# Altium schematic sheet Power Amplifier.SchDoc
size E
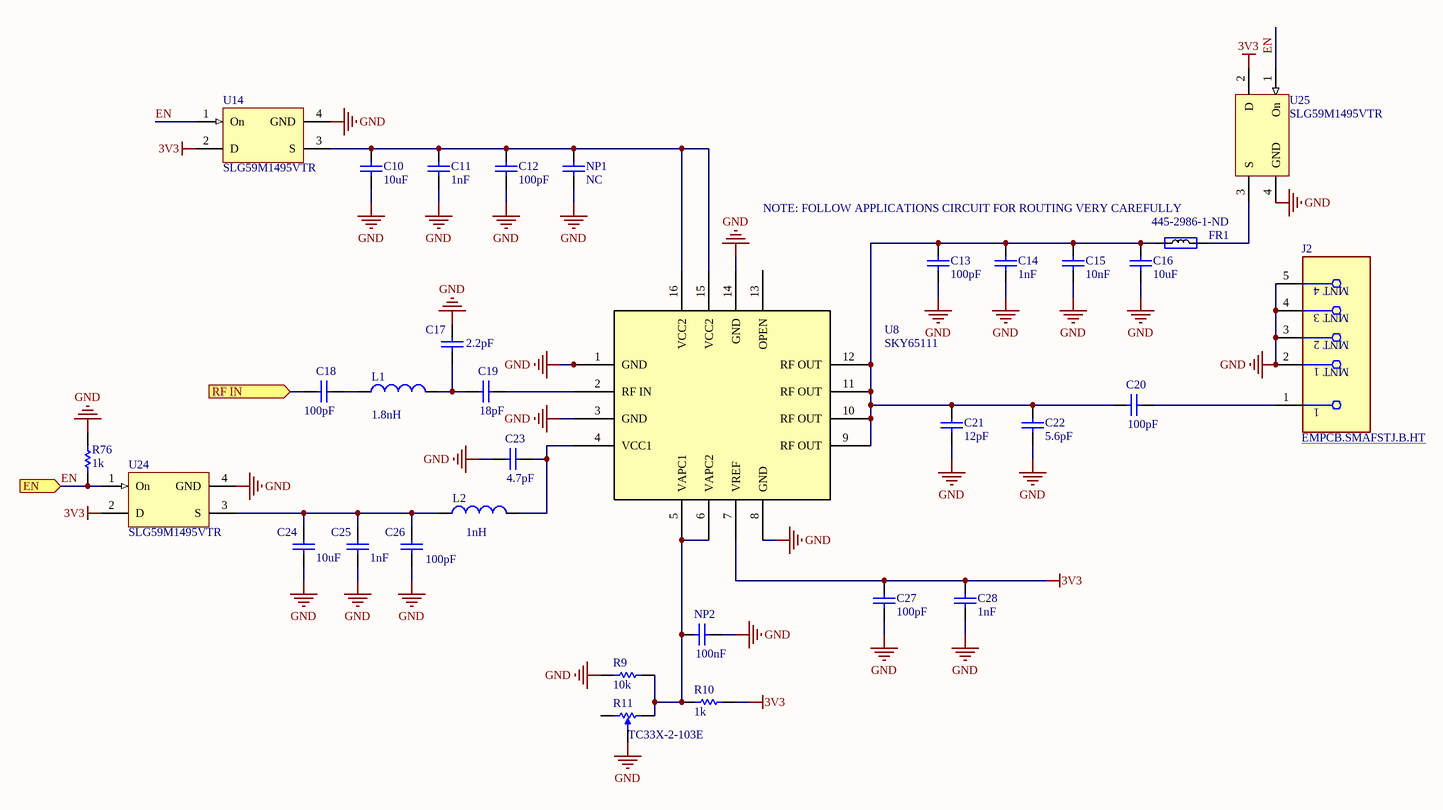
[diagram p0: Power Amplifier.SchDoc]

## Parts
C10  value 10uF  [C1206]  (hidden comment: Cap)
C11  value 1nF  [0402-A]  (hidden comment: Cap)
C12  value 100pF  [0402-A]  (hidden comment: Cap)
C13  value 100pF  [0402-A]  (hidden comment: Cap)
C14  value 1nF  [0402-A]  (hidden comment: Cap)
C15  value 10nF  [0402-A]  (hidden comment: Cap)
C16  value 10uF  [C1206]  (hidden comment: Cap)
C17  value 2.2pF  [0402-A]  (hidden comment: Cap)
C18  value 100pF  [0402-A]  (hidden comment: Cap)
C19  value 18pF  [0402-A]  (hidden comment: Cap)
C20  value 100pF  [0402-A]  (hidden comment: Cap)
C21  value 12pF  [0402-A]  (hidden comment: Cap)
C22  value 5.6pF  [0402-A]  (hidden comment: Cap)
C23  value 4.7pF  [0402-A]  (hidden comment: Cap)
C24  value 10uF  [C1206]  (hidden comment: Cap)
C25  value 1nF  [0402-A]  (hidden comment: Cap)
C26  value 100pF  [0402-A]  (hidden comment: Cap)
C27  value 100pF  [0402-A]  (hidden comment: Cap)
C28  value 1nF  [0402-A]  (hidden comment: Cap)
FR1  Supplier Part Number 1: 445-2986-1-ND  [1608[0603]]  (hidden comment: 200R, 1.8A)
J2  EMPCB.SMAFSTJ.B.HT  [FP-EMPCB_SMAFSTJ_B_HT-MFG]
L1  value 1.8nH  [0402-A]  (hidden comment: Inductor)
L2  value 1nH  [0402-A]  (hidden comment: Inductor)
NP1  value NC  [0402-A]  (hidden comment: Cap)
NP2  value 100nF  [0402-A]  (hidden comment: Cap)
R9  value 10k  [0402-A]  (hidden comment: Res1)
R10  value 1k  [0402-A]  (hidden comment: Res1)
R11  TC33X-2-103E  [BOUR-TC33X-2_V]
R76  value 1k  [0402-A]  (hidden comment: Res1)
U8  SKY65111  [SKY65111]
U14  SLG59M1495VTR  [SLG59M1495VTR]
U24  SLG59M1495VTR  [SLG59M1495VTR]
U25  SLG59M1495VTR  [SLG59M1495VTR]

## Ports
EN (in), RF IN (in)

## Nets
3V3: C27.2 C28.2 R10.2 U8.7(VREF) U14.2(D) U24.2(D) U25.2(D)
GND: C10.1 C11.1 C12.1 C13.1 C14.1 C15.1 C16.1 C17.1 C21.1 C22.1 C23.1 C24.1 C25.1 C26.1 C27.1 C28.1 J2.2(MNT_1) J2.3(MNT_2) J2.4(MNT_3) J2.5(MNT_4) NP1.1 NP2.2 R9.1 R11.2 R76.2 U8.1(GND) U8.3(GND) U8.8(GND) U8.14(GND) U8.17(GND) U14.4(GND) U24.4(GND) U25.4(GND)
EN: R76.1 U14.1(On) U24.1(On) U25.1(On) ; port EN
RF IN: C18.1 ; port RF IN
NetC10_2: C10.2 C11.2 C12.2 NP1.2 U8.15(VCC2) U8.16(VCC2) U14.3(S)
NetC13_2: C13.2 C14.2 C15.2 C16.2 C20.1 C21.2 C22.2 FR1.1 U8.9(RF_OUT) U8.10(RF_OUT) U8.11(RF_OUT) U8.12(RF_OUT)
NetC17_2: C17.2 C19.1 L1.2
NetC18_2: C18.2 L1.1
NetC19_2: C19.2 U8.2(RF_IN)
NetC20_2: C20.2 J2.1
NetC23_2: C23.2 L2.2 U8.4(VCC1)
NetC24_2: C24.2 C25.2 C26.2 L2.1 U24.3(S)
NetFR1_2: FR1.2 U25.3(S)
NetNP2_1: NP2.1 R9.2 R10.1 R11.3 U8.5(VAPC1) U8.6(VAPC2)

Not connected (* = marked no-connect by the designer): R11 1; U8 13(OPEN)

## Notes on the sheet
- NOTE: FOLLOW APPLICATIONS CIRCUIT FOR ROUTING VERY CAREFULLY

## Library data of the parts
C10-C28 NP1 NP2 = Cap: Capacitor; Published: 8-Jun-2000; LatestRevisionDate: 17-Jul-2002; LatestRevisionNote: Re-released for DXP Platform.; PackageReference: RAD-0.3; Publisher: Altium Limited; PackageDescription: Radial Cap, Thru-Hole; 2 Leads; 0.3 in Pin Spacing
FR1 = Ferrite: Manufacturer Part Number 1: BK0603TS601-T; Manufacturer: Taiyo Yuden; Part Description: FERRITE BEAD 600 OHM 0201 1LN; DC Resistance (DCR): 750 mOhm Max; Filter Type: Differential Mode - Single; Impedance @ Frequency: 600 Ohm @ 100MHz; Current Rating: 270mA; Value: 600R@100MHz; Size / Dimension: 0.024" L x 0.012" W (0.60mm x 0.30mm); Package / Case: 0201 (0603 Metric); Height (Max): 0.013" (0.33mm); Mounting Type: Surface Mount; Packaging: Cut Tape (CT); RoHS: RoHS Compliant; Category: Filters; Supplier 1: Digi-Key
J2 = CMP-111093-000001-1: CONN SMA JACK STR 50OHM EDGE MNT; Manufacturer: Taoglas Limited; Conn Orientation: Horizontal; Frequency: 12.4GHz; Impedance: 50Ω; Voltage Rating: 335V; Is Female: yes; Pitch: 2.62mm; Number Of Contacts: 1; Device Class L2: RF / Coaxial Connectors; Category: Conn; Contact Material: Gold; Device Class L1: Connectors; Digikey Description: CONN SMA JACK STR 50OHM EDGE MNT; Temperature Range Low: -40°C; Octopart: https://octopart.com/empcb.smafstj.b.ht-taoglas-24204431; ComponentLink2URL: https://cdn.taoglas.com/datasheets/EMPCB.SMAFSTJ.B.HT.pdf; Temperature Range High: +85°C; Device Class L3: unset; Temperature: -40°C to +85°C; Package: 0; RoHS: TRUE; Lead Free: Yes; Automotive: No; ComponentLink2Description: Datasheet; Mouser Description: RF Connectors / Coaxial Connectors SMA Straight Edge Mount PCB Jack-Gold; Manufacturer Part Number: EMPCB.SMAFSTJ.B.HT
L1 L2 = Inductor: Code_IEC: 1005; Published: 8-Jun-2000; LatestRevisionDate: 29-May-2009; LatestRevisionNote: IPC-7351 Footprint Added.; PackageReference: 0402-A; Publisher: Altium Limited; PackageDescription: Chip Inductor; Code_JEITA: 0402
R9 R10 R76 = Res1: Resistor; Published: 8-Jun-2000; LatestRevisionDate: 17-Jul-2002; LatestRevisionNote: Re-released for DXP Platform.; PackageReference: AXIAL-0.3; Publisher: Altium Limited; PackageDescription: Axial Device, Thru-Hole; 2 Leads; 0.3 in Pin Spacing
R11 = CMP-2100-03695-1: Trimming Potentiometer, 10000 Ohm, -40 to 100 degC, 3-Pin SMD, RoHS, Tape and Reel; Manufacturer: Bourns; Tolerance: 25%; Max Power Dissipation: 100mW; Number of Turns: 1; Resistance: 10KOhm; Temperature Coefficient: 250ppm/degreesC; Voltage Rating (DC): 50V; Datasheet URL: http://www.bourns.com/docs/Product-Datasheets/TC33.pdf; Composition: Potentiometer; Package Description: 3-Pin Surface Mount Device, Body 3.8 x 3.6 mm; Weight: 29.4mg; Power Rating: 100mW; Termination: FootPrint; Manufacturer URL: http://www.bourns.com/; Width: 0.118inch; Height: 0.047inch; Military Standard: Not; Radiation Hardening: No; Colour: Silver; Case/Package: SMD/SMT; Depth: 3.8mm; Min Operating Temperature: -40degC; Lead Free: LeadFree; Datasheet Version: 42583.0; REACH SVHC: NoSVHC; Length: 3mm; RoHSCompliant: true; Contact Plating: Silver; Taper: Linear; Packaging: TapeandReel; Mount: SurfaceMount; Max Operating Temperature: 100degC; Package Reference: TC33X-2; Package Quantity: 2500